# EAGLE schematic RF08bOmnibus (EAGLE 6.6.0)

## Sheet 1 of 4
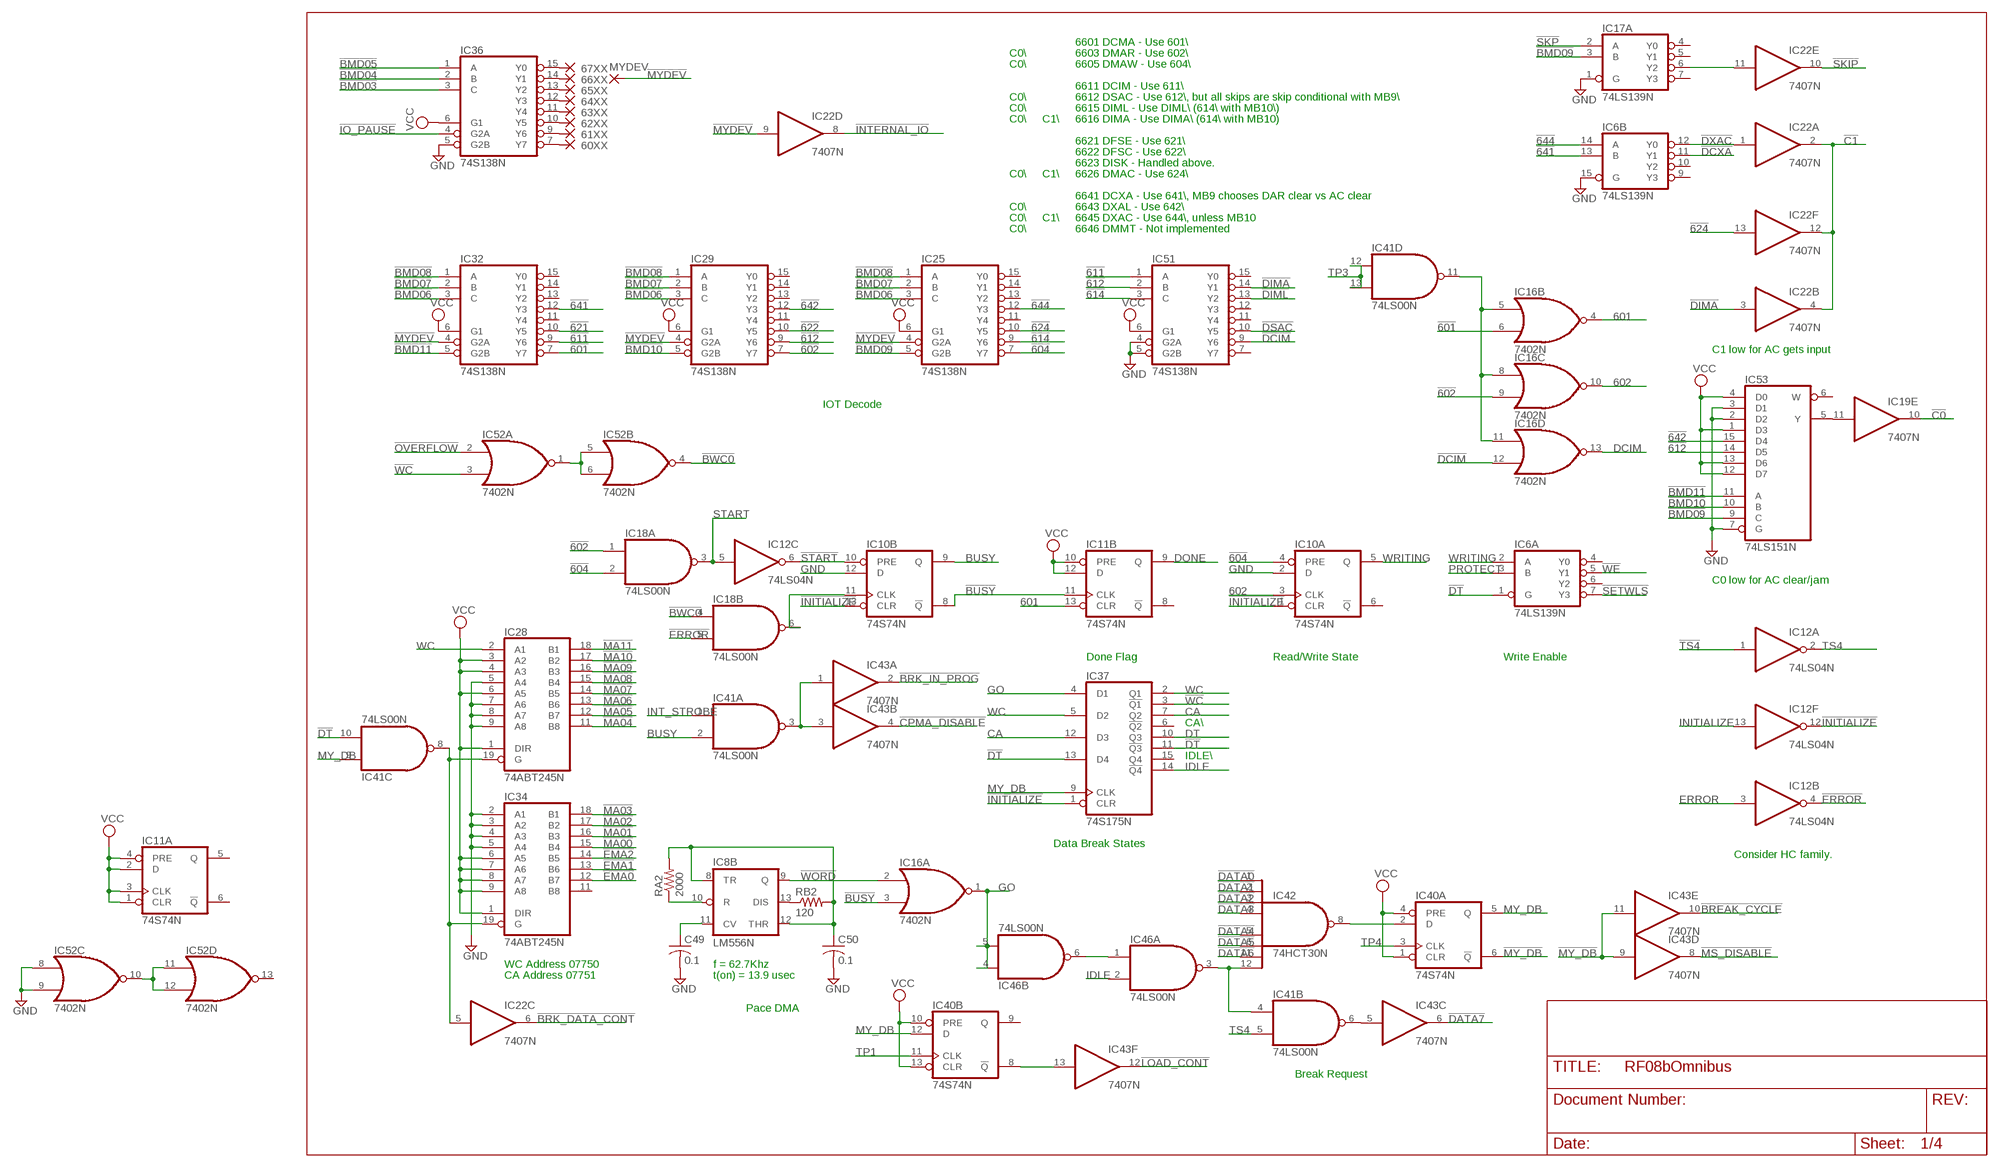
[diagram p0: schematic, sheet 1]

### Parts
60XX  1,6/0,8  [1,6/0,8]
61XX  1,6/0,8  [1,6/0,8]
62XX  1,6/0,8  [1,6/0,8]
63XX  1,6/0,8  [1,6/0,8]
64XX  1,6/0,8  [1,6/0,8]
65XX  1,6/0,8  [1,6/0,8]
66XX  1,6/0,8  [1,6/0,8]
67XX  1,6/0,8  [1,6/0,8]
C49  0.1  C-US050-025X075  [C050-025X075]
C50  0.1  C-US050-025X075  [C050-025X075]
IC6  74LS139N  74S139N  [DIL16]
IC8  LM556N  [DIL14]
IC10  74S74N  [DIL14]
IC11  74S74N  [DIL14]
IC12  74LS04N  [DIL14]
IC16  7402N  [DIL14]
IC17  74LS139N  74S139N  [DIL16]
IC18  74LS00N  [DIL14]
IC19  7407N  [DIL14]
IC22  7407N  [DIL14]
IC25  74S138N  [DIL16]
IC28  74ABT245N  74LS245N  [DIL20]
IC29  74S138N  [DIL16]
IC32  74S138N  [DIL16]
IC34  74ABT245N  74LS245N  [DIL20]
IC36  74S138N  [DIL16]
IC37  74S175N  [DIL16]
IC40  74S74N  [DIL14]
IC41  74LS00N  [DIL14]
IC42  74HCT30N  74LS30N  [DIL14]
IC43  7407N  [DIL14]
IC46  74LS00N  [DIL14]
IC51  74S138N  [DIL16]
IC52  7402N  [DIL14]
IC53  74LS151N  [DIL16]
MYDEV  1,6/0,8  [1,6/0,8]
RA2  2000  R-US_0207/10  [0207/10]
RB2  120  R-US_0207/10  [0207/10]

### Nets
601: IC11.13(B:CLR) IC16.4(B:O) ; also sheet 2
602: IC10.3(A:CLK) IC16.10(C:O)
!601: IC16.6(B:I1) IC32.7(Y7) ; also sheet 2
!602: IC16.9(C:I1) IC18.1(A:I0) IC29.7(Y7)
!604: IC10.4(A:PRE) IC18.2(A:I1) IC25.7(Y7)
!611: IC32.9(Y6) IC51.1(A)
!612: IC29.9(Y6) IC51.2(B) IC53.14(D5)
!614: IC25.9(Y6) IC51.3(C)
!621: IC32.10(Y5) ; also sheet 2
!622: IC29.10(Y5) ; also sheet 2
!624: IC22.13(F:I) IC25.10(Y5) ; also sheet 2
!641: IC6.13(B:B) IC32.12(Y3)
!642: IC29.12(Y3) IC53.15(D4) ; also sheet 2
!644: IC6.14(B:A) IC25.12(Y3)
!BMD03: IC36.3(C) ; also sheet 3
!BMD04: IC36.2(B) ; also sheet 3
!BMD05: IC36.1(A) ; also sheet 3
!BMD06: IC25.3(C) IC29.3(C) IC32.3(C) ; also sheet 3
!BMD07: IC25.2(B) IC29.2(B) IC32.2(B) ; also sheet 3
!BMD08: IC25.1(A) IC29.1(A) IC32.1(A) ; also sheet 3
!BMD09: IC17.3(A:B) IC25.5(G2B) IC53.9(C) ; also sheet 3
!BMD10: IC29.5(G2B) IC53.10(B) ; also sheet 3
!BMD11: IC32.5(G2B) IC53.11(A) ; also sheet 3
!BREAK_CYCLE: IC43.10(E:O) ; also sheet 4
!BRK_DATA_CONT: IC22.6(C:O) ; also sheet 4
!BRK_IN_PROG: IC43.2(A:O) ; also sheet 4
!BUSY: IC10.8(B:!Q) IC11.11(B:CLK) IC16.3(A:I1)
!BWC0: IC18.4(B:I0) IC52.4(B:O) ; also sheet 3
!C0: IC19.10(E:O) ; also sheet 4
!C1: IC22.2(A:O) IC22.4(B:O) IC22.12(F:O) ; also sheet 4
!CPMA_DISABLE: IC43.4(B:O) ; also sheet 4
!DATA0: IC42.1(I0) ; also sheet 2,3,4
!DATA1: IC42.2(I1) ; also sheet 2,3,4
!DATA2: IC42.3(I2) ; also sheet 2,3,4
!DATA3: IC42.4(I3) ; also sheet 2,3,4
!DATA4: IC42.5(I4) ; also sheet 2,3,4
!DATA5: IC42.6(I5) ; also sheet 2,3,4
!DATA6: IC42.11(I6) ; also sheet 2,3,4
!DATA7: IC43.6(C:O) ; also sheet 2,3,4
!DCIM: IC16.12(D:I1) IC51.9(Y6)
!DCXA: IC6.11(B:Y1) ; also sheet 2
!DIMA: IC22.3(B:I) IC51.14(Y1) ; also sheet 2
!DIML: IC51.13(Y2) ; also sheet 2
!DSAC: IC51.10(Y5) ; also sheet 2
!DT: IC6.1(A:G) IC37.11(!Q3) IC37.13(D4) IC41.10(C:I1) ; also sheet 3
!DXAC: IC6.12(B:Y0) IC22.1(A:I) ; also sheet 2
!EMA0: IC34.12(B7) ; also sheet 3,4
!EMA1: IC34.13(B6) ; also sheet 3,4
!EMA2: IC34.14(B5) ; also sheet 3,4
!ERROR: IC12.4(B:O) IC18.5(B:I1)
!INITIALIZE: IC10.1(A:CLR) IC10.13(B:CLR) IC12.12(F:O) IC37.1(CLR) ; also sheet 2
!INTERNAL_IO: IC22.8(D:O) ; also sheet 4
!IO_PAUSE: IC36.4(G2A) ; also sheet 4
!LOAD_CONT: IC43.12(F:O) ; also sheet 4
!MA00: IC34.15(B4) ; also sheet 3,4
!MA01: IC34.16(B3) ; also sheet 3,4
!MA02: IC34.17(B2) ; also sheet 3,4
!MA03: IC34.18(B1) ; also sheet 3,4
!MA04: IC28.11(B8) ; also sheet 3,4
!MA05: IC28.12(B7) ; also sheet 3,4
!MA06: IC28.13(B6) ; also sheet 3,4
!MA07: IC28.14(B5) ; also sheet 3,4
!MA08: IC28.15(B4) ; also sheet 3,4
!MA09: IC28.16(B3) ; also sheet 3,4
!MA10: IC28.17(B2) ; also sheet 3,4
!MA11: IC28.18(B1) ; also sheet 3,4
!MS_DISABLE: IC43.8(D:O) ; also sheet 4
!MY_DB: IC40.6(A:!Q) IC43.9(D:I) IC43.11(E:I) ; also sheet 3
!MYDEV: IC22.9(D:I) IC25.4(G2A) IC29.4(G2A) IC32.4(G2A) MYDEV.1(P)
!OVERFLOW: IC52.2(A:I0) ; also sheet 4
!SETWLS: IC6.7(A:Y3) ; also sheet 2
!SKIP: IC22.10(E:O) ; also sheet 4
!SKP: IC17.2(A:A) ; also sheet 2
!START: IC10.10(B:PRE) IC12.6(C:O) ; also sheet 2
!TS4: IC12.1(A:I) ; also sheet 4
!WC: IC37.3(!Q1) IC52.3(A:I1)
!WE: IC6.5(A:Y1) ; also sheet 3
!WORD: IC8.9(B:Q) IC16.2(A:I0)
BUSY: IC10.9(B:Q) IC41.2(A:I1) ; also sheet 2
CA: IC37.7(Q2) IC37.12(D3) ; also sheet 3
DCIM: IC16.13(D:O) ; also sheet 2
DONE: IC11.9(B:Q) ; also sheet 2,3
DT: IC37.10(Q3) ; also sheet 2
ERROR: IC12.3(B:I) ; also sheet 2
GND: C49.2 C50.2 IC6.15(B:G) IC10.2(A:D) IC10.12(B:D) IC17.1(A:G) IC28.5(A4) IC28.7(A6) IC28.8(A7) IC28.9(A8) IC34.2(A1) IC34.3(A2) IC34.4(A3) IC34.5(A4) IC36.5(G2B) IC51.4(G2A) IC51.5(G2B) IC52.8(C:I0) IC52.9(C:I1) IC53.2(D2) IC53.3(D1) IC53.7(G) ; also sheet 2,3,4
GO: IC16.1(A:O) IC37.4(D1) IC46.4(B:I0) IC46.5(B:I1)
IDLE: IC37.14(!Q4) IC46.2(A:I1)
INITIALIZE: IC12.13(F:I) ; also sheet 4
INT_STROBE: IC41.1(A:I0) ; also sheet 4
MY_DB: IC37.9(CLK) IC40.5(A:Q) IC40.12(B:D) IC41.9(C:I0)
N$1: 60XX.1(P) IC36.7(Y7)
N$2: IC19.11(E:I) IC53.5(Y)
N$5: 61XX.1(P) IC36.9(Y6)
N$6: 62XX.1(P) IC36.10(Y5)
N$7: 63XX.1(P) IC36.11(Y4)
N$8: 64XX.1(P) IC36.12(Y3)
N$9: 65XX.1(P) IC36.13(Y2)
N$10: 67XX.1(P) IC36.15(Y0)
N$11: 66XX.1(P) IC36.14(Y1)
N$18: IC10.11(B:CLK) IC18.6(B:O)
N$26: IC46.1(A:I0) IC46.6(B:O)
N$27: IC17.6(A:Y2) IC22.11(E:I)
N$30: IC16.5(B:I0) IC16.8(C:I0) IC16.11(D:I0) IC41.11(D:O)
N$37: IC40.8(B:!Q) IC43.13(F:I)
N$38: IC41.3(A:O) IC43.1(A:I) IC43.3(B:I)
N$39: IC41.6(B:O) IC43.5(C:I)
N$40: IC40.2(A:D) IC42.8(O)
N$43: IC22.5(C:I) IC28.19(G) IC34.19(G) IC41.8(C:O)
N$85: IC52.1(A:O) IC52.5(B:I0) IC52.6(B:I1)
N$86: IC8.13(B:DIS) RB2.1
N$87: C49.1 IC8.11(B:CV)
N$88: C50.1 IC8.8(B:TR) IC8.12(B:THR) RA2.2 RB2.2
N$89: IC8.10(B:R) RA2.1
N$92: IC52.10(C:O) IC52.11(D:I0) IC52.12(D:I1)
N$94: IC41.4(B:I0) IC42.12(I7) IC46.3(A:O)
PROTECT: IC6.3(A:B) ; also sheet 3
START: IC12.5(C:I) IC18.3(A:O)
TP1: IC40.11(B:CLK) ; also sheet 4
TP3: IC41.12(D:I0) IC41.13(D:I1) ; also sheet 3,4
TP4: IC40.3(A:CLK) ; also sheet 4
TS4: IC12.2(A:O) IC41.5(B:I1)
VCC [Power]: IC11.1(A:CLR) IC11.2(A:D) IC11.3(A:CLK) IC11.4(A:PRE) IC11.10(B:PRE) IC11.12(B:D) IC25.6(G1) IC28.1(DIR) IC28.3(A2) IC28.4(A3) IC28.6(A5) IC29.6(G1) IC32.6(G1) IC34.1(DIR) IC34.6(A5) IC34.7(A6) IC34.8(A7) IC34.9(A8) IC36.6(G1) IC40.1(A:CLR) IC40.4(A:PRE) IC40.10(B:PRE) IC40.13(B:CLR) IC51.6(G1) IC53.1(D3) IC53.4(D0) IC53.12(D7) IC53.13(D6) ; also sheet 2,3,4
WC: IC28.2(A1) IC37.2(Q1) IC37.5(D2)
WRITING: IC6.2(A:A) IC10.5(A:Q) ; also sheet 3
Unconnected: IC6.4(A:Y0) IC6.6(A:Y2) IC6.9(B:Y3) IC6.10(B:Y2) IC10.6(A:!Q) IC11.5(A:Q) IC11.6(A:!Q) IC11.8(B:!Q) IC17.4(A:Y0) IC17.5(A:Y1) IC17.7(A:Y3) IC25.11(Y4) IC25.13(Y2) IC25.14(Y1) IC25.15(Y0) IC29.11(Y4) IC29.13(Y2) IC29.14(Y1) IC29.15(Y0) IC32.11(Y4) IC32.13(Y2) IC32.14(Y1) IC32.15(Y0) IC34.11(B8) IC37.6(!Q2) IC37.15(Q4) IC40.9(B:Q) IC51.7(Y7) IC51.11(Y4) IC51.12(Y3) IC51.15(Y0) IC52.13(D:O) IC53.6(W)

### Notes on the sheet
- 6601 DCMA - Use 601\\
- C0\\ | 6603 DMAR - Use 602\\
- C0\\ | 6605 DMAW - Use 604\\
- 6611 DCIM - Use 611\\
- C0\\ | 6612 DSAC - Use 612\\, but all skips are skip conditional with MB9\\
- C0\\ | 6615 DIML - Use DIML\\ (614\\ with MB10\\)
- C0\\ | C1\\ | 6616 DIMA - Use DIMA\\ (614\\ with MB10)
- 6621 DFSE - Use 621\\
- 6622 DFSC - Use 622\\
- 6623 DISK - Handled above.
- C0\\ | C1\\ | 6626 DMAC - Use 624\\
- 6641 DCXA - Use 641\\, MB9 chooses DAR clear vs AC clear
- C0\\ | 6643 DXAL - Use 642\\
- C0\\ | C1\\ | 6645 DXAC - Use 644\\, unless MB10
- C0\\ | 6646 DMMT - Not implemented
- C1 low for AC gets input
- IOT Decode
- C0 low for AC clear/jam
- Done Flag | Read/Write State | Write Enable
- CA\\
- IDLE\\
- Data Break States
- Consider HC family.
- WC Address 07750 | f = 62.7Khz
- CA Address 07751 | t(on) = 13.9 usec
- Pace DMA
- Break Request

## Sheet 2 of 4
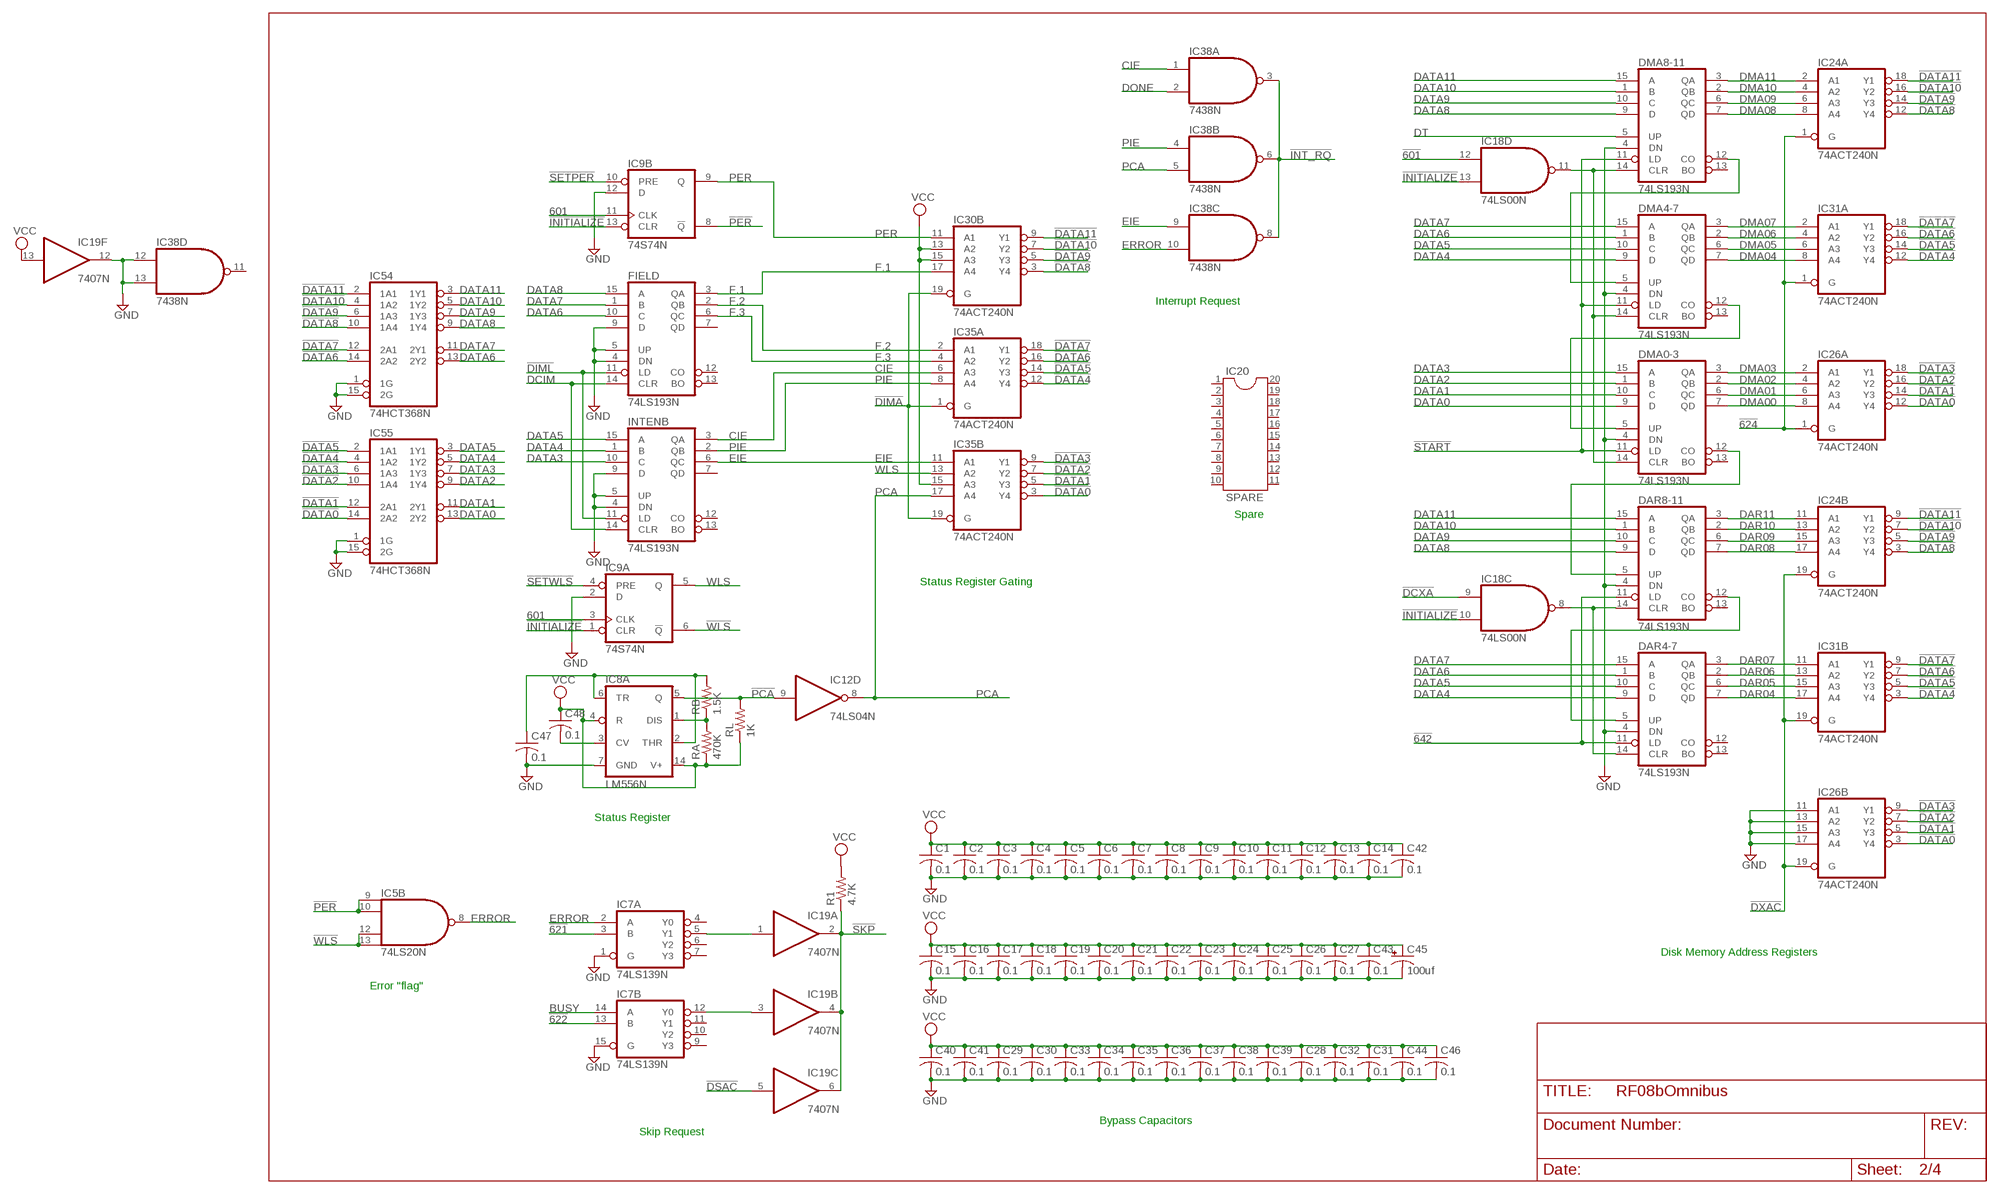
[diagram p1: schematic, sheet 2]

### Parts
C1  0.1  C-US050-025X075  [C050-025X075]
C2  0.1  C-US050-025X075  [C050-025X075]
C3  0.1  C-US050-025X075  [C050-025X075]
C4  0.1  C-US050-025X075  [C050-025X075]
C5  0.1  C-US050-025X075  [C050-025X075]
C6  0.1  C-US050-025X075  [C050-025X075]
C7  0.1  C-US050-025X075  [C050-025X075]
C8  0.1  C-US050-025X075  [C050-025X075]
C9  0.1  C-US050-025X075  [C050-025X075]
C10  0.1  C-US050-025X075  [C050-025X075]
C11  0.1  C-US050-025X075  [C050-025X075]
C12  0.1  C-US050-025X075  [C050-025X075]
C13  0.1  C-US050-025X075  [C050-025X075]
C14  0.1  C-US050-025X075  [C050-025X075]
C15  0.1  C-US050-025X075  [C050-025X075]
C16  0.1  C-US050-025X075  [C050-025X075]
C17  0.1  C-US050-025X075  [C050-025X075]
C18  0.1  C-US050-025X075  [C050-025X075]
C19  0.1  C-US050-025X075  [C050-025X075]
C20  0.1  C-US050-025X075  [C050-025X075]
C21  0.1  C-US050-025X075  [C050-025X075]
C22  0.1  C-US050-025X075  [C050-025X075]
C23  0.1  C-US050-025X075  [C050-025X075]
C24  0.1  C-US050-025X075  [C050-025X075]
C25  0.1  C-US050-025X075  [C050-025X075]
C26  0.1  C-US050-025X075  [C050-025X075]
C27  0.1  C-US050-025X075  [C050-025X075]
C28  0.1  C-US050-025X075  [C050-025X075]
C29  0.1  C-US050-025X075  [C050-025X075]
C30  0.1  C-US050-025X075  [C050-025X075]
C31  0.1  C-US050-025X075  [C050-025X075]
C32  0.1  C-US050-025X075  [C050-025X075]
C33  0.1  C-US050-025X075  [C050-025X075]
C34  0.1  C-US050-025X075  [C050-025X075]
C35  0.1  C-US050-025X075  [C050-025X075]
C36  0.1  C-US050-025X075  [C050-025X075]
C37  0.1  C-US050-025X075  [C050-025X075]
C38  0.1  C-US050-025X075  [C050-025X075]
C39  0.1  C-US050-025X075  [C050-025X075]
C40  0.1  C-US050-025X075  [C050-025X075]
C41  0.1  C-US050-025X075  [C050-025X075]
C42  0.1  C-US050-025X075  [C050-025X075]
C43  0.1  C-US050-025X075  [C050-025X075]
C44  0.1  C-US050-025X075  [C050-025X075]
C45  100uf  CPOL-USE22-6AXIAL  [E22-6]
C46  0.1  C-US050-025X075  [C050-025X075]
C47  0.1  C-US050-025X075  [C050-025X075]
C48  0.1  C-US050-025X075  [C050-025X075]
DAR4-7  74LS193N  74LS192N  [DIL16]
DAR8-11  74LS193N  74LS192N  [DIL16]
DMA0-3  74LS193N  74LS192N  [DIL16]
DMA4-7  74LS193N  74LS192N  [DIL16]
DMA8-11  74LS193N  74LS192N  [DIL16]
FIELD  74LS193N  74LS192N  [DIL16]
IC5  74LS20N  [DIL14]
IC7  74LS139N  [DIL16]
IC9  74S74N  [DIL14]
IC20  SPARE  DIL20  [DIL20]
IC24  74ACT240N  74LS240N  [DIL20]
IC26  74ACT240N  74LS240N  [DIL20]
IC30  74ACT240N  74LS240N  [DIL20]
IC31  74ACT240N  74LS240N  [DIL20]
IC35  74ACT240N  74LS240N  [DIL20]
IC38  7438N  [DIL14]
IC54  74HCT368N  74368N  [DIL16]
IC55  74HCT368N  74368N  [DIL16]
INTENB  74LS193N  74LS192N  [DIL16]
R1  4.7K  R-US_0207/10  [0207/10]
RA  470K  R-US_0207/10  [0207/10]
RB  1.5K  R-US_0207/10  [0207/10]
RL  1K  R-US_0207/10  [0207/10]

### Nets
601: IC9.3(A:CLK) IC9.11(B:CLK) ; also sheet 1
!601: IC18.12(D:I0) ; also sheet 1
!621: IC7.3(A:B) ; also sheet 1
!622: IC7.13(B:B) ; also sheet 1
!624: IC24.1(A:G) IC26.1(A:G) IC31.1(A:G) ; also sheet 1
!642: DAR4-7.11(LD) DAR8-11.11(LD) ; also sheet 1
!DATA0: IC26.3(B:Y4) IC26.12(A:Y4) IC35.3(B:Y4) IC55.14(2A2) ; also sheet 1,3,4
!DATA1: IC26.5(B:Y3) IC26.14(A:Y3) IC35.5(B:Y3) IC55.12(2A1) ; also sheet 1,3,4
!DATA2: IC26.7(B:Y2) IC26.16(A:Y2) IC35.7(B:Y2) IC55.10(1A4) ; also sheet 1,3,4
!DATA3: IC26.9(B:Y1) IC26.18(A:Y1) IC35.9(B:Y1) IC55.6(1A3) ; also sheet 1,3,4
!DATA4: IC31.3(B:Y4) IC31.12(A:Y4) IC35.12(A:Y4) IC55.4(1A2) ; also sheet 1,3,4
!DATA5: IC31.5(B:Y3) IC31.14(A:Y3) IC35.14(A:Y3) IC55.2(1A1) ; also sheet 1,3,4
!DATA6: IC31.7(B:Y2) IC31.16(A:Y2) IC35.16(A:Y2) IC54.14(2A2) ; also sheet 1,3,4
!DATA7: IC31.9(B:Y1) IC31.18(A:Y1) IC35.18(A:Y1) IC54.12(2A1) ; also sheet 1,3,4
!DATA8: IC24.3(B:Y4) IC24.12(A:Y4) IC30.3(B:Y4) IC54.10(1A4) ; also sheet 3,4
!DATA9: IC24.5(B:Y3) IC24.14(A:Y3) IC30.5(B:Y3) IC54.6(1A3) ; also sheet 3,4
!DATA10: IC24.7(B:Y2) IC24.16(A:Y2) IC30.7(B:Y2) IC54.4(1A2) ; also sheet 3,4
!DATA11: IC24.9(B:Y1) IC24.18(A:Y1) IC30.9(B:Y1) IC54.2(1A1) ; also sheet 3,4
!DCXA: IC18.9(C:I0) ; also sheet 1
!DIMA: IC30.19(B:G) IC35.1(A:G) IC35.19(B:G) ; also sheet 1
!DIML: FIELD.11(LD) INTENB.11(LD) ; also sheet 1
!DSAC: IC19.5(C:I) ; also sheet 1
!DXAC: IC24.19(B:G) IC26.19(B:G) IC31.19(B:G) ; also sheet 1
!INITIALIZE: IC9.1(A:CLR) IC9.13(B:CLR) IC18.10(C:I1) IC18.13(D:I1) ; also sheet 1
!INT_RQ: IC38.3(A:O) IC38.6(B:O) IC38.8(C:O)
!PCA: IC8.5(A:Q) IC12.9(D:I) RL.2
!PER: IC5.9(B:I0) IC5.10(B:I1) IC9.8(B:!Q)
!SETPER: IC9.10(B:PRE) ; also sheet 3
!SETWLS: IC9.4(A:PRE) ; also sheet 1
!SKP: IC19.2(A:O) IC19.4(B:O) IC19.6(C:O) R1.1 ; also sheet 1
!START: DMA0-3.11(LD) DMA4-7.11(LD) DMA8-11.11(LD) ; also sheet 1
!WLS: IC5.12(B:I2) IC5.13(B:I3) IC9.6(A:!Q)
BUSY: IC7.14(B:A) ; also sheet 1
CIE: IC35.6(A:A3) IC38.1(A:I0) INTENB.3(QA) ; also sheet 3
DAR04: DAR4-7.7(QD) IC31.17(B:A4) ; also sheet 3
DAR05: DAR4-7.6(QC) IC31.15(B:A3) ; also sheet 3
DAR06: DAR4-7.2(QB) IC31.13(B:A2) ; also sheet 3
DAR07: DAR4-7.3(QA) IC31.11(B:A1) ; also sheet 3
DAR08: DAR8-11.7(QD) IC24.17(B:A4) ; also sheet 3
DAR09: DAR8-11.6(QC) IC24.15(B:A3) ; also sheet 3
DAR10: DAR8-11.2(QB) IC24.13(B:A2) ; also sheet 3
DAR11: DAR8-11.3(QA) IC24.11(B:A1) ; also sheet 3
DATA0: DMA0-3.9(D) IC55.13(2Y2)
DATA1: DMA0-3.10(C) IC55.11(2Y1)
DATA2: DMA0-3.1(B) IC55.9(1Y4)
DATA3: DMA0-3.15(A) IC55.7(1Y3) INTENB.10(C)
DATA4: DAR4-7.9(D) DMA4-7.9(D) IC55.5(1Y2) INTENB.1(B)
DATA5: DAR4-7.10(C) DMA4-7.10(C) IC55.3(1Y1) INTENB.15(A)
DATA6: DAR4-7.1(B) DMA4-7.1(B) FIELD.10(C) IC54.13(2Y2)
DATA7: DAR4-7.15(A) DMA4-7.15(A) FIELD.1(B) IC54.11(2Y1)
DATA8: DAR8-11.9(D) DMA8-11.9(D) FIELD.15(A) IC54.9(1Y4)
DATA9: DAR8-11.10(C) DMA8-11.10(C) IC54.7(1Y3)
DATA10: DAR8-11.1(B) DMA8-11.1(B) IC54.5(1Y2)
DATA11: DAR8-11.15(A) DMA8-11.15(A) IC54.3(1Y1)
DCIM: FIELD.14(CLR) INTENB.14(CLR) ; also sheet 1
DMA00: DMA0-3.7(QD) IC26.8(A:A4) ; also sheet 3
DMA01: DMA0-3.6(QC) IC26.6(A:A3) ; also sheet 3
DMA02: DMA0-3.2(QB) IC26.4(A:A2) ; also sheet 3
DMA03: DMA0-3.3(QA) IC26.2(A:A1) ; also sheet 3
DMA04: DMA4-7.7(QD) IC31.8(A:A4) ; also sheet 3
DMA05: DMA4-7.6(QC) IC31.6(A:A3) ; also sheet 3
DMA06: DMA4-7.2(QB) IC31.4(A:A2) ; also sheet 3
DMA07: DMA4-7.3(QA) IC31.2(A:A1) ; also sheet 3
DMA08: DMA8-11.7(QD) IC24.8(A:A4) ; also sheet 3
DMA09: DMA8-11.6(QC) IC24.6(A:A3) ; also sheet 3
DMA10: DMA8-11.2(QB) IC24.4(A:A2) ; also sheet 3
DMA11: DMA8-11.3(QA) IC24.2(A:A1) ; also sheet 3
DONE: IC38.2(A:I1) ; also sheet 1,3
DT: DMA8-11.5(UP) ; also sheet 1
EIE: IC35.11(B:A1) IC38.9(C:I0) INTENB.6(QC) ; also sheet 3
ERROR: IC5.8(B:O) IC7.2(A:A) IC38.10(C:I1) ; also sheet 1
F.1: FIELD.3(QA) IC30.17(B:A4) ; also sheet 3
F.2: FIELD.2(QB) IC35.2(A:A1) ; also sheet 3
F.3: FIELD.6(QC) IC35.4(A:A2) ; also sheet 3
GND: C1.2 C2.2 C3.2 C4.2 C5.2 C6.2 C7.2 C8.2 C9.2 C10.2 C11.2 C12.2 C13.2 C14.2 C15.2 C16.2 C17.2 C18.2 C19.2 C20.2 C21.2 C22.2 C23.2 C24.2 C25.2 C26.2 C27.2 C28.2 C29.2 C30.2 C31.2 C32.2 C33.2 C34.2 C35.2 C36.2 C37.2 C38.2 C39.2 C40.2 C41.2 C42.2 C43.2 C44.2 C45.- C46.2 C47.2 DAR4-7.4(DN) DAR8-11.4(DN) DMA0-3.4(DN) DMA4-7.4(DN) DMA8-11.4(DN) FIELD.4(DN) FIELD.5(UP) FIELD.9(D) IC7.1(A:G) IC7.15(B:G) IC8.7(A:GND) IC9.2(A:D) IC9.12(B:D) IC19.12(F:O) IC26.11(B:A1) IC26.13(B:A2) IC26.15(B:A3) IC26.17(B:A4) IC38.12(D:I0) IC38.13(D:I1) IC54.1(1G) IC54.15(2G) IC55.1(1G) IC55.15(2G) INTENB.4(DN) INTENB.5(UP) INTENB.9(D) ; also sheet 1,3,4
N$3: DMA0-3.5(UP) DMA4-7.12(CO)
N$12: DAR4-7.14(CLR) DAR8-11.14(CLR) IC18.8(C:O)
N$13: DMA4-7.5(UP) DMA8-11.12(CO)
N$16: DAR8-11.5(UP) DMA0-3.12(CO)
N$22: DMA0-3.14(CLR) DMA4-7.14(CLR) DMA8-11.14(CLR) IC18.11(D:O)
N$25: DAR4-7.5(UP) DAR8-11.12(CO)
N$28: IC7.5(A:Y1) IC19.1(A:I)
N$29: IC8.1(A:DIS) RA.2 RB.1
N$32: C47.1 IC8.2(A:THR) IC8.6(A:TR) RB.2
N$33: IC7.12(B:Y0) IC19.3(B:I)
N$34: C48.2 IC8.3(A:CV)
PCA: IC12.8(D:O) IC35.17(B:A4) IC38.5(B:I1)
PER: IC9.9(B:Q) IC30.11(B:A1) ; also sheet 3
PIE: IC35.8(A:A4) IC38.4(B:I0) INTENB.2(QB) ; also sheet 3
VCC [Power]: C1.1 C2.1 C3.1 C4.1 C5.1 C6.1 C7.1 C8.1 C9.1 C10.1 C11.1 C12.1 C13.1 C14.1 C15.1 C16.1 C17.1 C18.1 C19.1 C20.1 C21.1 C22.1 C23.1 C24.1 C25.1 C26.1 C27.1 C28.1 C29.1 C30.1 C31.1 C32.1 C33.1 C34.1 C35.1 C36.1 C37.1 C38.1 C39.1 C40.1 C41.1 C42.1 C43.1 C44.1 C45.+ C46.1 C48.1 IC8.4(A:R) IC8.14(A:V+) IC19.13(F:I) IC30.13(B:A2) IC30.15(B:A3) IC35.15(B:A3) R1.2 RA.1 RL.1 ; also sheet 1,3,4
WLS: IC9.5(A:Q) IC35.13(B:A2) ; also sheet 3
Unconnected: DAR4-7.12(CO) DAR4-7.13(BO) DAR8-11.13(BO) DMA0-3.13(BO) DMA4-7.13(BO) DMA8-11.13(BO) FIELD.7(QD) FIELD.12(CO) FIELD.13(BO) IC7.4(A:Y0) IC7.6(A:Y2) IC7.7(A:Y3) IC7.9(B:Y3) IC7.10(B:Y2) IC7.11(B:Y1) IC20.1 IC20.2 IC20.3 IC20.4 IC20.5 IC20.6 IC20.7 IC20.8 IC20.9 IC20.10 IC20.11 IC20.12 IC20.13 IC20.14 IC20.15 IC20.16 IC20.17 IC20.18 IC20.19 IC20.20 IC38.11(D:O) INTENB.7(QD) INTENB.12(CO) INTENB.13(BO)

### Notes on the sheet
- Interrupt Request
- Spare
- Status Register Gating
- Status Register
- Disk Memory Address Registers
- Error "flag"
- Bypass Capacitors
- Skip Request

## Sheet 3 of 4
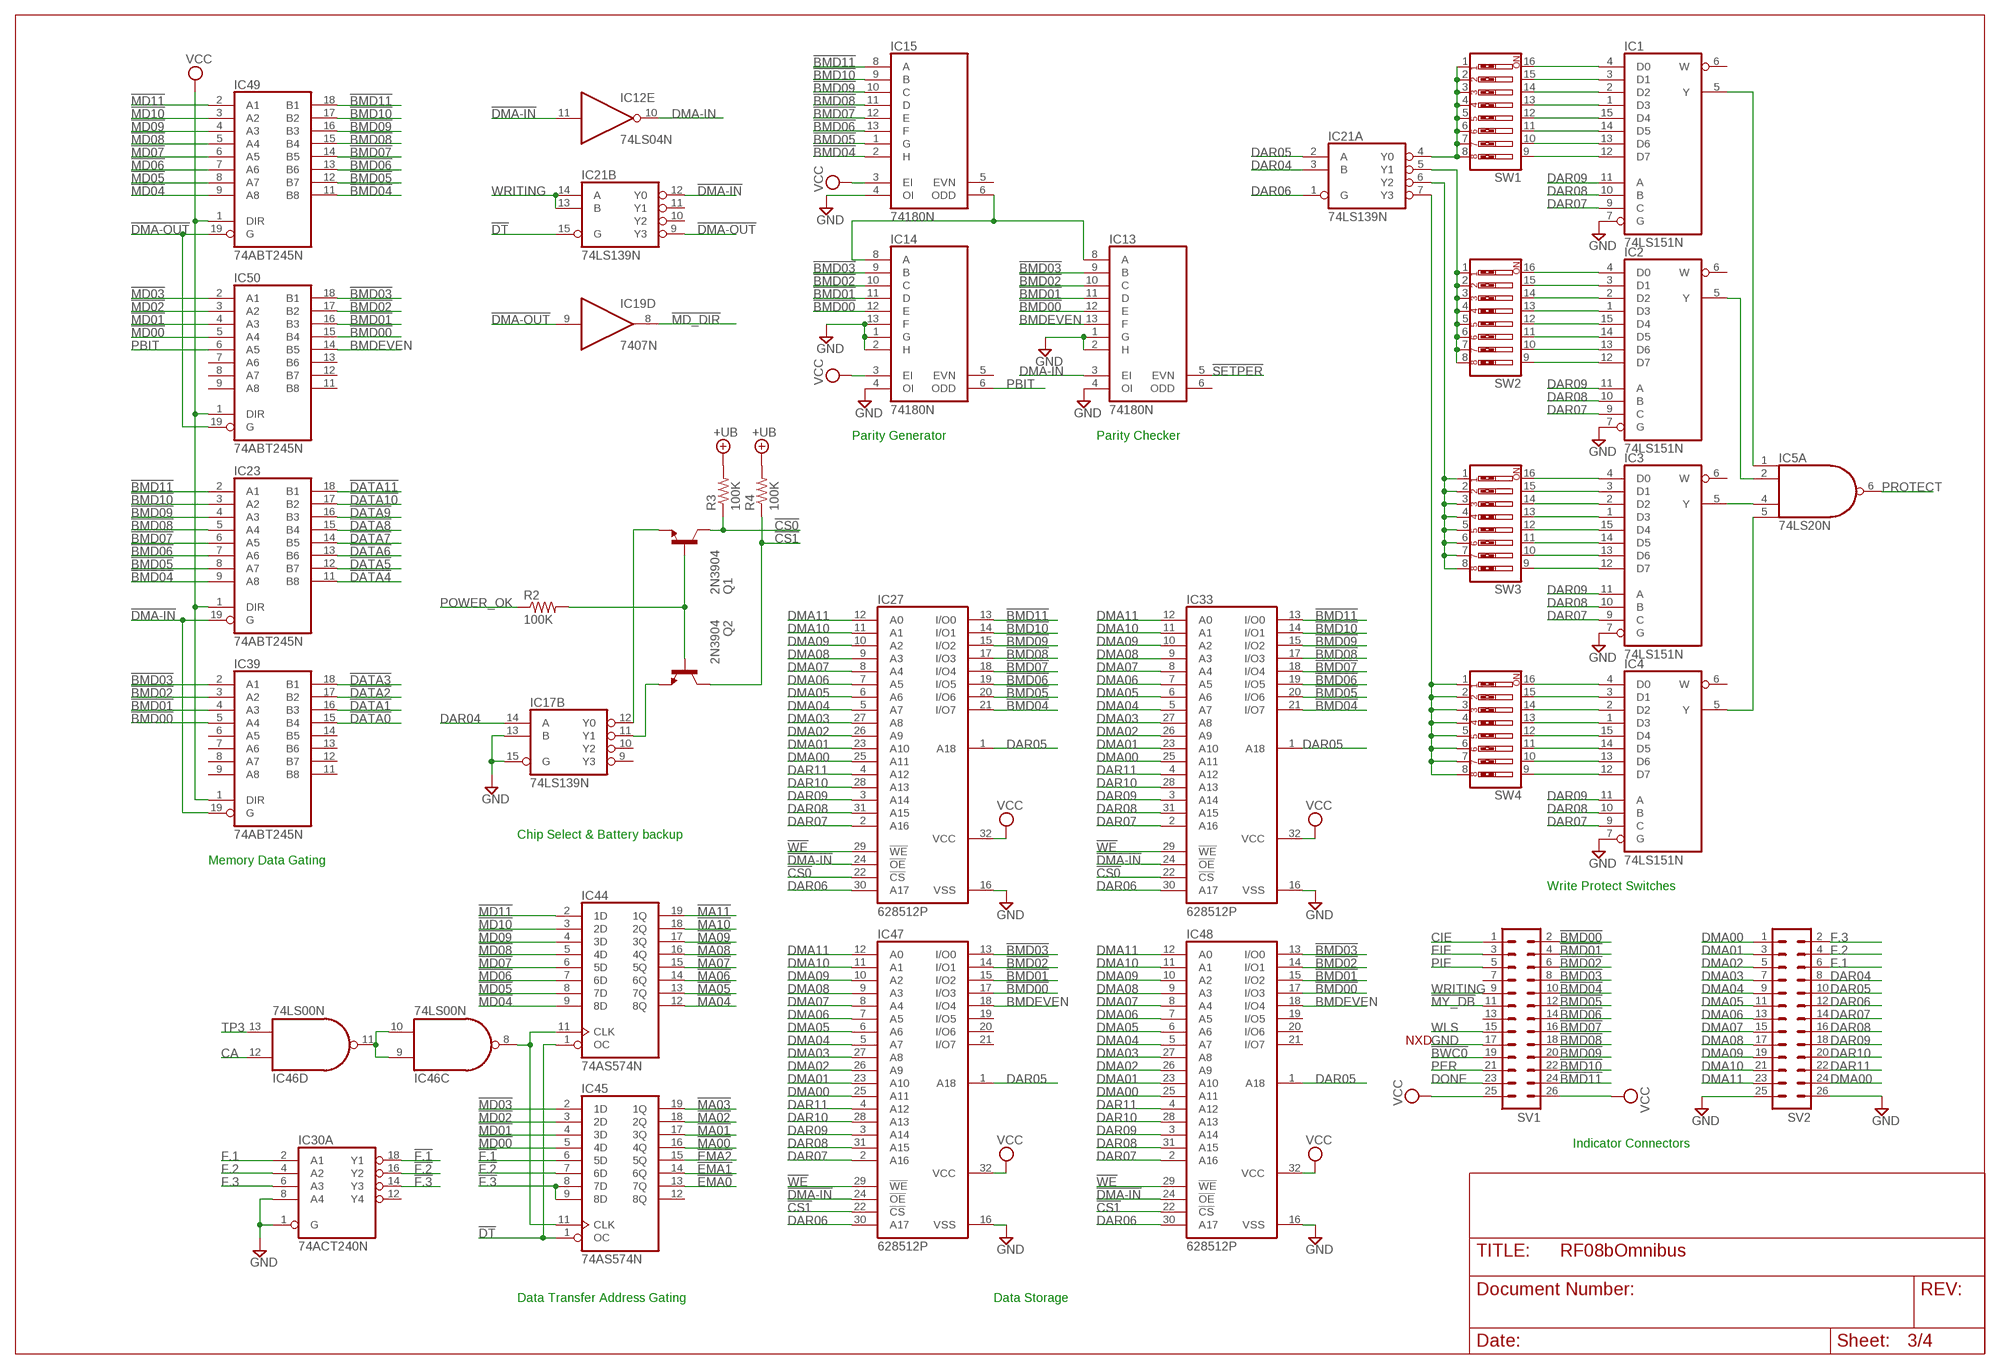
[diagram p2: schematic, sheet 3]

### Parts
IC1  74LS151N  [DIL16]
IC2  74LS151N  [DIL16]
IC3  74LS151N  [DIL16]
IC4  74LS151N  [DIL16]
IC13  74180N  [DIL14]
IC14  74180N  [DIL14]
IC15  74180N  [DIL14]
IC21  74LS139N  [DIL16]
IC23  74ABT245N  74LS245N  [DIL20]
IC27  628512P  [DIL32]
IC33  628512P  [DIL32]
IC39  74ABT245N  74LS245N  [DIL20]
IC44  74AS574N  [DIL20]
IC45  74AS574N  [DIL20]
IC47  628512P  [DIL32]
IC48  628512P  [DIL32]
IC49  74ABT245N  74LS245N  [DIL20]
IC50  74ABT245N  74LS245N  [DIL20]
Q1  2N3904  [TO92]
Q2  2N3904  [TO92]
R2  100K  R-US_0207/10  [0207/10]
R3  100K  R-US_0207/10  [0207/10]
R4  100K  R-US_0207/10  [0207/10]
SV1  MA13-2  [MA13-2]
SV2  MA13-2  [MA13-2]
SW1  SW_DIP-8  [EDG-08]
SW2  SW_DIP-8  [EDG-08]
SW3  SW_DIP-8  [EDG-08]
SW4  SW_DIP-8  [EDG-08]

### Nets
!BMD00: IC13.12(E) IC14.12(E) IC39.5(A4) IC47.17(I/O3) IC48.17(I/O3) IC50.15(B4) SV1.2
!BMD01: IC13.11(D) IC14.11(D) IC39.4(A3) IC47.15(I/O2) IC48.15(I/O2) IC50.16(B3) SV1.4
!BMD02: IC13.10(C) IC14.10(C) IC39.3(A2) IC47.14(I/O1) IC48.14(I/O1) IC50.17(B2) SV1.6
!BMD03: IC13.9(B) IC14.9(B) IC39.2(A1) IC47.13(I/O0) IC48.13(I/O0) IC50.18(B1) SV1.8 ; also sheet 1
!BMD04: IC15.2(H) IC23.9(A8) IC27.21(I/O7) IC33.21(I/O7) IC49.11(B8) SV1.10 ; also sheet 1
!BMD05: IC15.1(G) IC23.8(A7) IC27.20(I/O6) IC33.20(I/O6) IC49.12(B7) SV1.12 ; also sheet 1
!BMD06: IC15.13(F) IC23.7(A6) IC27.19(I/O5) IC33.19(I/O5) IC49.13(B6) SV1.14 ; also sheet 1
!BMD07: IC15.12(E) IC23.6(A5) IC27.18(I/O4) IC33.18(I/O4) IC49.14(B5) SV1.16 ; also sheet 1
!BMD08: IC15.11(D) IC23.5(A4) IC27.17(I/O3) IC33.17(I/O3) IC49.15(B4) SV1.18 ; also sheet 1
!BMD09: IC15.10(C) IC23.4(A3) IC27.15(I/O2) IC33.15(I/O2) IC49.16(B3) SV1.20 ; also sheet 1
!BMD10: IC15.9(B) IC23.3(A2) IC27.14(I/O1) IC33.14(I/O1) IC49.17(B2) SV1.22 ; also sheet 1
!BMD11: IC15.8(A) IC23.2(A1) IC27.13(I/O0) IC33.13(I/O0) IC49.18(B1) SV1.24 ; also sheet 1
!BWC0: SV1.19 ; also sheet 1
!CS0: IC27.22(!CS) IC33.22(!CS) Q1.1(C) R3.1
!CS1: IC47.22(!CS) IC48.22(!CS) Q2.1(C) R4.1
!DATA0: IC39.15(B4) ; also sheet 1,2,4
!DATA1: IC39.16(B3) ; also sheet 1,2,4
!DATA2: IC39.17(B2) ; also sheet 1,2,4
!DATA3: IC39.18(B1) ; also sheet 1,2,4
!DATA4: IC23.11(B8) ; also sheet 1,2,4
!DATA5: IC23.12(B7) ; also sheet 1,2,4
!DATA6: IC23.13(B6) ; also sheet 1,2,4
!DATA7: IC23.14(B5) ; also sheet 1,2,4
!DATA8: IC23.15(B4) ; also sheet 2,4
!DATA9: IC23.16(B3) ; also sheet 2,4
!DATA10: IC23.17(B2) ; also sheet 2,4
!DATA11: IC23.18(B1) ; also sheet 2,4
!DMA-IN: IC12.11(E:I) IC21.12(B:Y0) IC23.19(G) IC27.24(!OE) IC33.24(!OE) IC39.19(G) IC47.24(!OE) IC48.24(!OE)
!DMA-OUT: IC19.9(D:I) IC21.9(B:Y3) IC49.19(G) IC50.19(G)
!DT: IC21.15(B:G) IC44.1(OC) IC45.1(OC) ; also sheet 1
!EMA0: IC45.13(7Q) ; also sheet 1,4
!EMA1: IC45.14(6Q) ; also sheet 1,4
!EMA2: IC45.15(5Q) ; also sheet 1,4
!F.1: IC30.18(A:Y1) IC45.6(5D)
!F.2: IC30.16(A:Y2) IC45.7(6D)
!F.3: IC30.14(A:Y3) IC45.8(7D) IC45.9(8D)
!MA00: IC45.16(4Q) ; also sheet 1,4
!MA01: IC45.17(3Q) ; also sheet 1,4
!MA02: IC45.18(2Q) ; also sheet 1,4
!MA03: IC45.19(1Q) ; also sheet 1,4
!MA04: IC44.12(8Q) ; also sheet 1,4
!MA05: IC44.13(7Q) ; also sheet 1,4
!MA06: IC44.14(6Q) ; also sheet 1,4
!MA07: IC44.15(5Q) ; also sheet 1,4
!MA08: IC44.16(4Q) ; also sheet 1,4
!MA09: IC44.17(3Q) ; also sheet 1,4
!MA10: IC44.18(2Q) ; also sheet 1,4
!MA11: IC44.19(1Q) ; also sheet 1,4
!MD00: IC45.5(4D) IC50.5(A4) ; also sheet 4
!MD01: IC45.4(3D) IC50.4(A3) ; also sheet 4
!MD02: IC45.3(2D) IC50.3(A2) ; also sheet 4
!MD03: IC45.2(1D) IC50.2(A1) ; also sheet 4
!MD04: IC44.9(8D) IC49.9(A8) ; also sheet 4
!MD05: IC44.8(7D) IC49.8(A7) ; also sheet 4
!MD06: IC44.7(6D) IC49.7(A6) ; also sheet 4
!MD07: IC44.6(5D) IC49.6(A5) ; also sheet 4
!MD08: IC44.5(4D) IC49.5(A4) ; also sheet 4
!MD09: IC44.4(3D) IC49.4(A3) ; also sheet 4
!MD10: IC44.3(2D) IC49.3(A2) ; also sheet 4
!MD11: IC44.2(1D) IC49.2(A1) ; also sheet 4
!MD_DIR: IC19.8(D:O) ; also sheet 4
!MY_DB: SV1.11 ; also sheet 1
!SETPER: IC13.5(EVN) ; also sheet 2
!WE: IC27.29(!WE) IC33.29(!WE) IC47.29(!WE) IC48.29(!WE) ; also sheet 1
+UB: R3.2 R4.2
BMDEVEN: IC13.13(F) IC47.18(I/O4) IC48.18(I/O4) IC50.14(B5)
CA: IC46.12(D:I0) ; also sheet 1
CIE: SV1.1 ; also sheet 2
DAR04: IC17.14(B:A) IC21.3(A:B) SV2.8 ; also sheet 2
DAR05: IC21.2(A:A) IC27.1(A18) IC33.1(A18) IC47.1(A18) IC48.1(A18) SV2.10 ; also sheet 2
DAR06: IC21.1(A:G) IC27.30(A17) IC33.30(A17) IC47.30(A17) IC48.30(A17) SV2.12 ; also sheet 2
DAR07: IC1.9(C) IC2.9(C) IC3.9(C) IC4.9(C) IC27.2(A16) IC33.2(A16) IC47.2(A16) IC48.2(A16) SV2.14 ; also sheet 2
DAR08: IC1.10(B) IC2.10(B) IC3.10(B) IC4.10(B) IC27.31(A15) IC33.31(A15) IC47.31(A15) IC48.31(A15) SV2.16 ; also sheet 2
DAR09: IC1.11(A) IC2.11(A) IC3.11(A) IC4.11(A) IC27.3(A14) IC33.3(A14) IC47.3(A14) IC48.3(A14) SV2.18 ; also sheet 2
DAR10: IC27.28(A13) IC33.28(A13) IC47.28(A13) IC48.28(A13) SV2.20 ; also sheet 2
DAR11: IC27.4(A12) IC33.4(A12) IC47.4(A12) IC48.4(A12) SV2.22 ; also sheet 2
DMA00: IC27.25(A11) IC33.25(A11) IC47.25(A11) IC48.25(A11) SV2.1 SV2.24 ; also sheet 2
DMA01: IC27.23(A10) IC33.23(A10) IC47.23(A10) IC48.23(A10) SV2.3 ; also sheet 2
DMA02: IC27.26(A9) IC33.26(A9) IC47.26(A9) IC48.26(A9) SV2.5 ; also sheet 2
DMA03: IC27.27(A8) IC33.27(A8) IC47.27(A8) IC48.27(A8) SV2.7 ; also sheet 2
DMA04: IC27.5(A7) IC33.5(A7) IC47.5(A7) IC48.5(A7) SV2.9 ; also sheet 2
DMA05: IC27.6(A6) IC33.6(A6) IC47.6(A6) IC48.6(A6) SV2.11 ; also sheet 2
DMA06: IC27.7(A5) IC33.7(A5) IC47.7(A5) IC48.7(A5) SV2.13 ; also sheet 2
DMA07: IC27.8(A4) IC33.8(A4) IC47.8(A4) IC48.8(A4) SV2.15 ; also sheet 2
DMA08: IC27.9(A3) IC33.9(A3) IC47.9(A3) IC48.9(A3) SV2.17 ; also sheet 2
DMA09: IC27.10(A2) IC33.10(A2) IC47.10(A2) IC48.10(A2) SV2.19 ; also sheet 2
DMA10: IC27.11(A1) IC33.11(A1) IC47.11(A1) IC48.11(A1) SV2.21 ; also sheet 2
DMA11: IC27.12(A0) IC33.12(A0) IC47.12(A0) IC48.12(A0) SV2.23 ; also sheet 2
DMA-IN: IC12.10(E:O) IC13.3(EI)
DONE: SV1.23 ; also sheet 1,2
EIE: SV1.3 ; also sheet 2
F.1: IC30.2(A:A1) SV2.6 ; also sheet 2
F.2: IC30.4(A:A2) SV2.4 ; also sheet 2
F.3: IC30.6(A:A3) SV2.2 ; also sheet 2
GND: IC1.7(G) IC2.7(G) IC3.7(G) IC4.7(G) IC13.1(G) IC13.2(H) IC13.4(OI) IC14.1(G) IC14.2(H) IC14.4(OI) IC14.13(F) IC15.4(OI) IC17.13(B:B) IC17.15(B:G) IC27.16(VSS) IC30.1(A:G) IC30.8(A:A4) IC33.16(VSS) IC47.16(VSS) IC48.16(VSS) SV1.17 SV2.25 SV2.26 ; also sheet 1,2,4
N$4: IC21.4(A:Y0) SW1.1 SW1.2 SW1.3 SW1.4 SW1.5 SW1.6 SW1.7 SW1.8
N$14: IC13.8(A) IC14.8(A) IC15.6(ODD)
N$15: IC2.5(Y) IC5.2(A:I1)
N$17: IC21.5(A:Y1) SW2.1 SW2.2 SW2.3 SW2.4 SW2.5 SW2.6 SW2.7 SW2.8
N$19: IC21.6(A:Y2) SW3.1 SW3.2 SW3.3 SW3.4 SW3.5 SW3.6 SW3.7 SW3.8
N$20: IC21.7(A:Y3) SW4.1 SW4.2 SW4.3 SW4.4 SW4.5 SW4.6 SW4.7 SW4.8
N$21: IC3.5(Y) IC5.4(A:I2)
N$23: IC1.5(Y) IC5.1(A:I0)
N$24: IC4.5(Y) IC5.5(A:I3)
N$41: IC44.11(CLK) IC45.11(CLK) IC46.8(C:O)
N$42: IC46.9(C:I0) IC46.10(C:I1) IC46.11(D:O)
N$53: IC1.4(D0) SW1.16
N$54: IC1.3(D1) SW1.15
N$55: IC1.2(D2) SW1.14
N$56: IC1.1(D3) SW1.13
N$57: IC1.14(D5) SW1.11
N$58: IC1.13(D6) SW1.10
N$59: IC1.12(D7) SW1.9
N$60: IC1.15(D4) SW1.12
N$61: IC2.4(D0) SW2.16
N$62: IC2.3(D1) SW2.15
N$63: IC2.2(D2) SW2.14
N$64: IC2.1(D3) SW2.13
N$65: IC2.14(D5) SW2.11
N$66: IC2.13(D6) SW2.10
N$67: IC2.12(D7) SW2.9
N$68: IC3.4(D0) SW3.16
N$69: IC3.3(D1) SW3.15
N$70: IC3.2(D2) SW3.14
N$71: IC3.1(D3) SW3.13
N$72: IC3.14(D5) SW3.11
N$73: IC3.13(D6) SW3.10
N$74: IC3.12(D7) SW3.9
N$75: IC4.4(D0) SW4.16
N$76: IC4.3(D1) SW4.15
N$77: IC4.2(D2) SW4.14
N$78: IC4.1(D3) SW4.13
N$79: IC4.14(D5) SW4.11
N$80: IC4.13(D6) SW4.10
N$81: IC4.12(D7) SW4.9
N$82: IC4.15(D4) SW4.12
N$83: IC3.15(D4) SW3.12
N$84: IC2.15(D4) SW2.12
N$90: IC17.12(B:Y0) Q1.3(E)
N$91: Q1.2(B) Q2.2(B) R2.2
N$93: IC17.11(B:Y1) Q2.3(E)
PBIT: IC14.6(ODD) IC50.6(A5)
PER: SV1.21 ; also sheet 2
PIE: SV1.5 ; also sheet 2
POWER_OK: R2.1 ; also sheet 4
PROTECT: IC5.6(A:O) ; also sheet 1
TP3: IC46.13(D:I1) ; also sheet 1,4
VCC [Power]: IC14.3(EI) IC15.3(EI) IC23.1(DIR) IC27.32(VCC) IC33.32(VCC) IC39.1(DIR) IC47.32(VCC) IC48.32(VCC) IC49.1(DIR) IC50.1(DIR) SV1.25 SV1.26 ; also sheet 1,2,4
WLS: SV1.15 ; also sheet 2
WRITING: IC21.13(B:B) IC21.14(B:A) SV1.9 ; also sheet 1
Unconnected: IC1.6(W) IC2.6(W) IC3.6(W) IC4.6(W) IC13.6(ODD) IC14.5(EVN) IC15.5(EVN) IC17.9(B:Y3) IC17.10(B:Y2) IC21.10(B:Y2) IC21.11(B:Y1) IC30.12(A:Y4) IC39.6(A5) IC39.7(A6) IC39.8(A7) IC39.9(A8) IC39.11(B8) IC39.12(B7) IC39.13(B6) IC39.14(B5) IC45.12(8Q) IC47.19(I/O5) IC47.20(I/O6) IC47.21(I/O7) IC48.19(I/O5) IC48.20(I/O6) IC48.21(I/O7) IC50.7(A6) IC50.8(A7) IC50.9(A8) IC50.11(B8) IC50.12(B7) IC50.13(B6) SV1.7 SV1.13

### Notes on the sheet
- Parity Generator | Parity Checker
- Chip Select & Battery backup
- Memory Data Gating
- Write Protect Switches
- NXD
- Indicator Connectors
- Data Transfer Address Gating | Data Storage

## Sheet 4 of 4
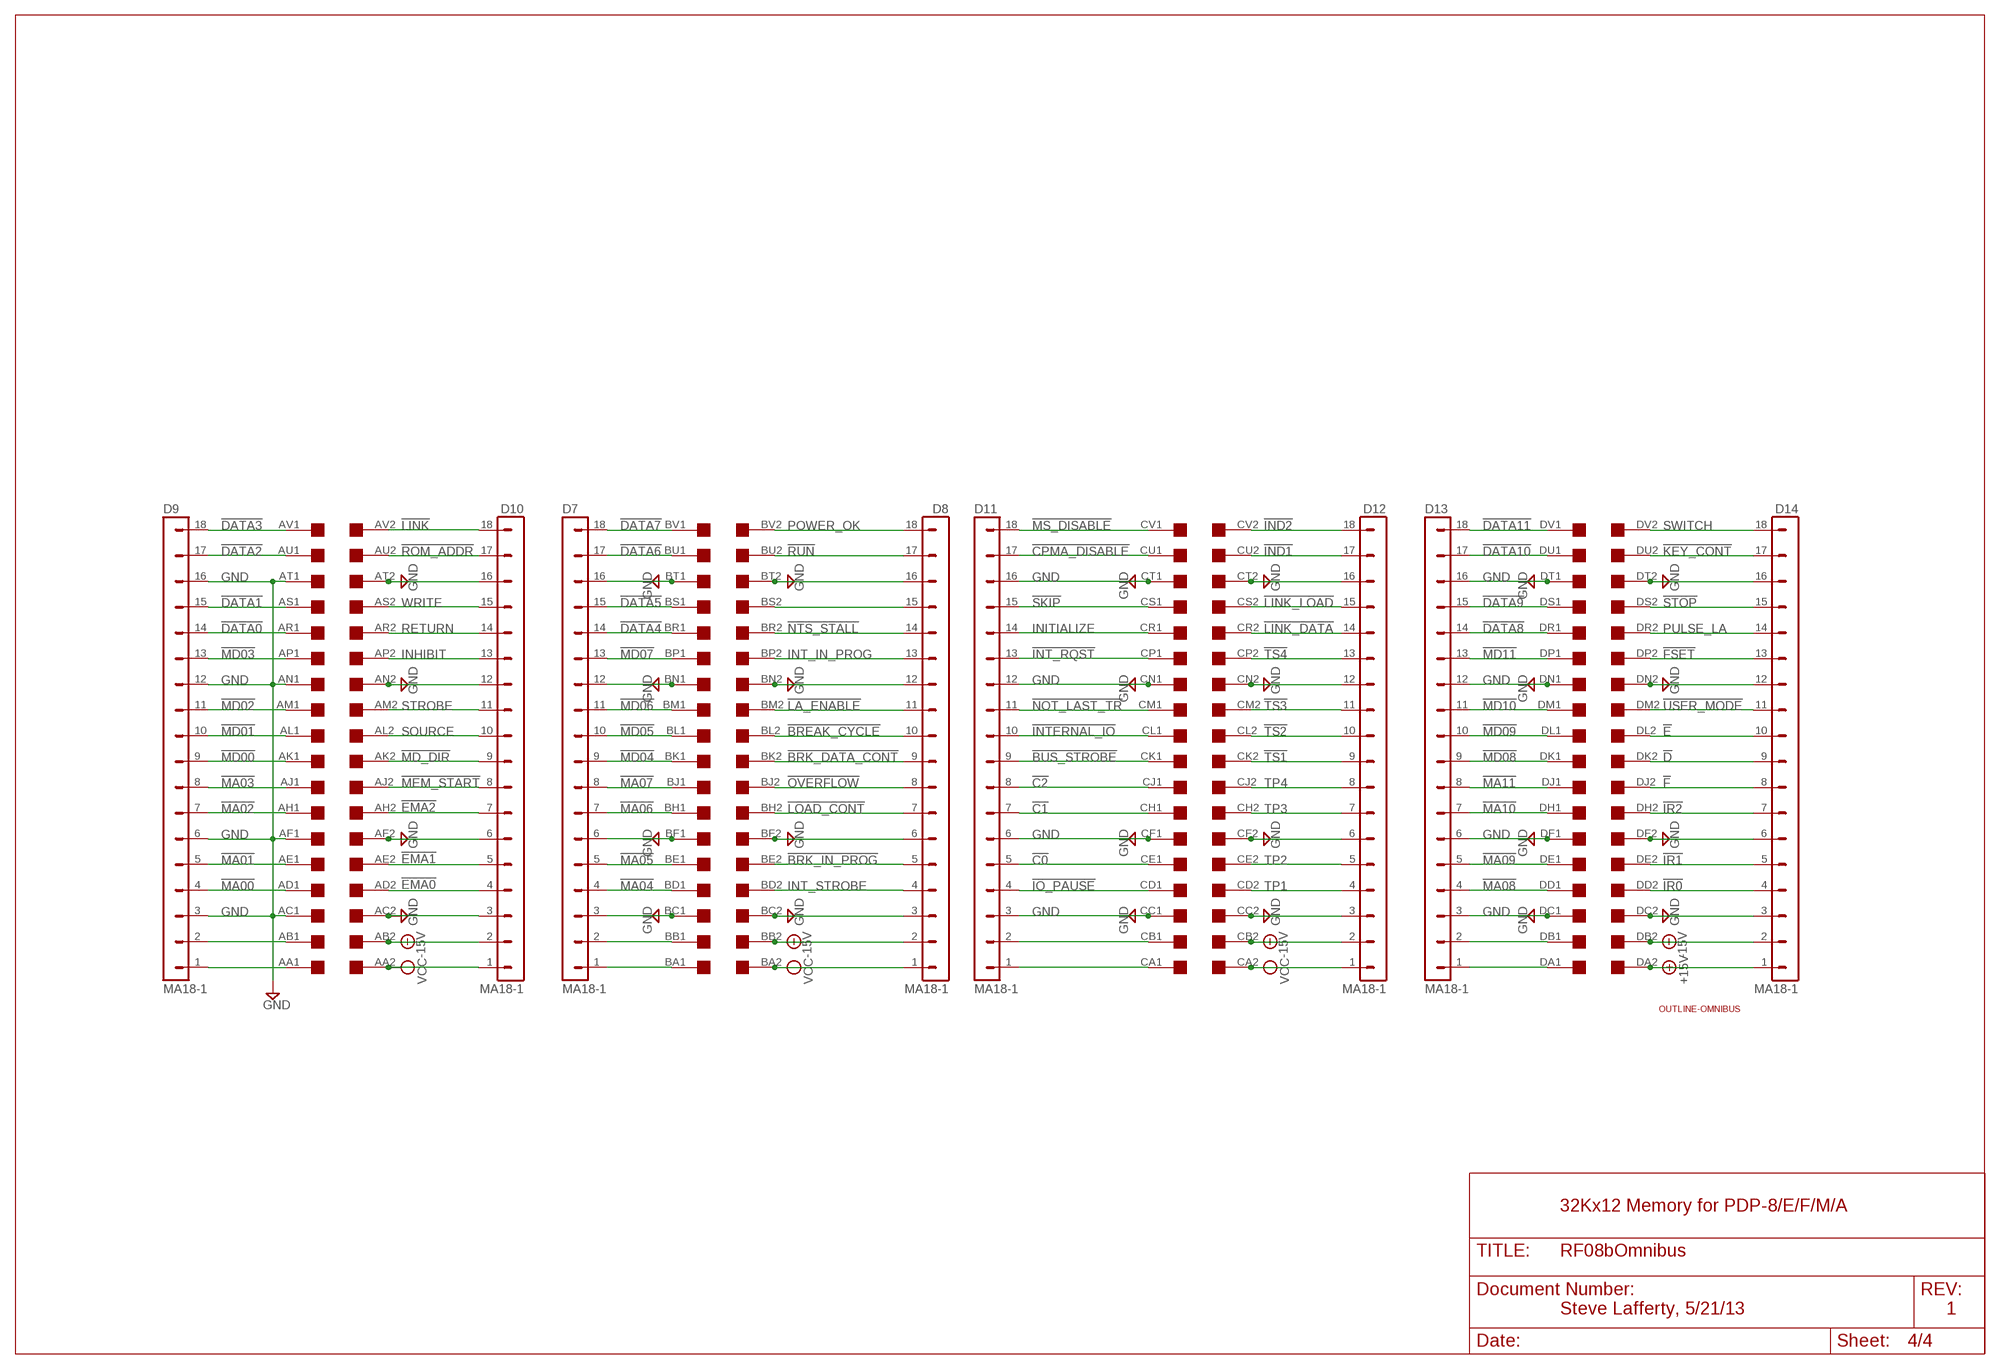
[diagram p3: schematic, sheet 4]

### Parts
D7  MA18-1  [MA18-1]
D8  MA18-1  [MA18-1]
D9  MA18-1  [MA18-1]
D10  MA18-1  [MA18-1]
D11  MA18-1  [MA18-1]
D12  MA18-1  [MA18-1]
D13  MA18-1  [MA18-1]
D14  MA18-1  [MA18-1]
U$15  OUTLINE-OMNIBUS  [OMNIBUS]
U$19  QUAD  [EDGE-CON8]

### Nets
!BREAK_CYCLE: D8.10 U$19.BL2 ; also sheet 1
!BRK_DATA_CONT: D8.9 U$19.BK2 ; also sheet 1
!BRK_IN_PROG: D8.5 U$19.BE2 ; also sheet 1
!BUS_STROBE: D11.9 U$19.CK1
!C0: D11.5 U$19.CE1 ; also sheet 1
!C1: D11.7 U$19.CH1 ; also sheet 1
!C2: D11.8 U$19.CJ1
!CPMA_DISABLE: D11.17 U$19.CU1 ; also sheet 1
!D: D14.9 U$19.DK2
!DATA0: D9.14 U$19.AR1 ; also sheet 1,2,3
!DATA1: D9.15 U$19.AS1 ; also sheet 1,2,3
!DATA2: D9.17 U$19.AU1 ; also sheet 1,2,3
!DATA3: D9.18 U$19.AV1 ; also sheet 1,2,3
!DATA4: D7.14 U$19.BR1 ; also sheet 1,2,3
!DATA5: D7.15 U$19.BS1 ; also sheet 1,2,3
!DATA6: D7.17 U$19.BU1 ; also sheet 1,2,3
!DATA7: D7.18 U$19.BV1 ; also sheet 1,2,3
!DATA8: D13.14 U$19.DR1 ; also sheet 2,3
!DATA9: D13.15 U$19.DS1 ; also sheet 2,3
!DATA10: D13.17 U$19.DU1 ; also sheet 2,3
!DATA11: D13.18 U$19.DV1 ; also sheet 2,3
!E: D14.10 U$19.DL2
!EMA0: D10.4 U$19.AD2 ; also sheet 1,3
!EMA1: D10.5 U$19.AE2 ; also sheet 1,3
!EMA2: D10.7 U$19.AH2 ; also sheet 1,3
!F: D14.8 U$19.DJ2
!FSET: D14.13 U$19.DP2
!IND1: D12.17 U$19.CU2
!IND2: D12.18 U$19.CV2
!INT_RQST: D11.13 U$19.CP1
!INTERNAL_IO: D11.10 U$19.CL1 ; also sheet 1
!IO_PAUSE: D11.4 U$19.CD1 ; also sheet 1
!IR0: D14.4 U$19.DD2
!IR1: D14.5 U$19.DE2
!IR2: D14.7 U$19.DH2
!KEY_CONT: D14.17 U$19.DU2
!LA_ENABLE: D8.11 U$19.BM2
!LINK: D10.18 U$19.AV2
!LINK_DATA: D12.14 U$19.CR2
!LINK_LOAD: D12.15 U$19.CS2
!LOAD_CONT: D8.7 U$19.BH2 ; also sheet 1
!MA00: D9.4 U$19.AD1 ; also sheet 1,3
!MA01: D9.5 U$19.AE1 ; also sheet 1,3
!MA02: D9.7 U$19.AH1 ; also sheet 1,3
!MA03: D9.8 U$19.AJ1 ; also sheet 1,3
!MA04: D7.4 U$19.BD1 ; also sheet 1,3
!MA05: D7.5 U$19.BE1 ; also sheet 1,3
!MA06: D7.7 U$19.BH1 ; also sheet 1,3
!MA07: D7.8 U$19.BJ1 ; also sheet 1,3
!MA08: D13.4 U$19.DD1 ; also sheet 1,3
!MA09: D13.5 U$19.DE1 ; also sheet 1,3
!MA10: D13.7 U$19.DH1 ; also sheet 1,3
!MA11: D13.8 U$19.DJ1 ; also sheet 1,3
!MD00: D9.9 U$19.AK1 ; also sheet 3
!MD01: D9.10 U$19.AL1 ; also sheet 3
!MD02: D9.11 U$19.AM1 ; also sheet 3
!MD03: D9.13 U$19.AP1 ; also sheet 3
!MD04: D7.9 U$19.BK1 ; also sheet 3
!MD05: D7.10 U$19.BL1 ; also sheet 3
!MD06: D7.11 U$19.BM1 ; also sheet 3
!MD07: D7.13 U$19.BP1 ; also sheet 3
!MD08: D13.9 U$19.DK1 ; also sheet 3
!MD09: D13.10 U$19.DL1 ; also sheet 3
!MD10: D13.11 U$19.DM1 ; also sheet 3
!MD11: D13.13 U$19.DP1 ; also sheet 3
!MD_DIR: D10.9 U$19.AK2 ; also sheet 3
!MEM_START: D10.8 U$19.AJ2
!MS_DISABLE: D11.18 U$19.CV1 ; also sheet 1
!NOT_LAST_TR: D11.11 U$19.CM1
!NTS_STALL: D8.14 U$19.BR2
!OVERFLOW: D8.8 U$19.BJ2 ; also sheet 1
!ROM_ADDR: D10.17 U$19.AU2
!RUN: D8.17 U$19.BU2
!SKIP: D11.15 U$19.CS1 ; also sheet 1
!STOP: D14.15 U$19.DS2
!TS1: D12.9 U$19.CK2
!TS2: D12.10 U$19.CL2
!TS3: D12.11 U$19.CM2
!TS4: D12.13 U$19.CP2 ; also sheet 1
!USER_MODE: D14.11 U$19.DM2
+15V: D14.1 U$19.DA2
-15V [Power]: D8.2 D10.2 D12.2 D14.2 U$19.AB2 U$19.BB2 U$19.CB2 U$19.DB2
GND: D7.3 D7.6 D7.12 D7.16 D8.3 D8.6 D8.12 D8.16 D9.3 D9.6 D9.12 D9.16 D10.3 D10.6 D10.12 D10.16 D11.3 D11.6 D11.12 D11.16 D12.3 D12.6 D12.12 D12.16 D13.3 D13.6 D13.12 D13.16 D14.3 D14.6 D14.12 D14.16 U$19.AC1 U$19.AC2 U$19.AF1 U$19.AF2 U$19.AN1 U$19.AN2 U$19.AT1 U$19.AT2 U$19.BC1 U$19.BC2 U$19.BF1 U$19.BF2 U$19.BN1 U$19.BN2 U$19.BT1 U$19.BT2 U$19.CC1 U$19.CC2 U$19.CF1 U$19.CF2 U$19.CN1 U$19.CN2 U$19.CT1 U$19.CT2 U$19.DC1 U$19.DC2 U$19.DF1 U$19.DF2 U$19.DN1 U$19.DN2 U$19.DT1 U$19.DT2 ; also sheet 1,2,3
INHIBIT: D10.13 U$19.AP2
INITIALIZE: D11.14 U$19.CR1 ; also sheet 1
INT_IN_PROG: D8.13 U$19.BP2
INT_STROBE: D8.4 U$19.BD2 ; also sheet 1
N$31: D13.1 U$19.DA1
N$35: D13.2 U$19.DB1
N$46: D9.2 U$19.AB1
N$47: D9.1 U$19.AA1
N$48: D7.2 U$19.BB1
N$49: D7.1 U$19.BA1
N$50: D11.1 U$19.CA1
N$51: D8.15 U$19.BS2
N$52: D11.2 U$19.CB1
POWER_OK: D8.18 U$19.BV2 ; also sheet 3
PULSE_LA: D14.14 U$19.DR2
RETURN: D10.14 U$19.AR2
SOURCE: D10.10 U$19.AL2
STROBE: D10.11 U$19.AM2
SWITCH: D14.18 U$19.DV2
TP1: D12.4 U$19.CD2 ; also sheet 1
TP2: D12.5 U$19.CE2
TP3: D12.7 U$19.CH2 ; also sheet 1,3
TP4: D12.8 U$19.CJ2 ; also sheet 1
VCC [Power]: D8.1 D10.1 D12.1 U$19.AA2 U$19.BA2 U$19.CA2 ; also sheet 1,2,3
WRITE: D10.15 U$19.AS2

### Notes on the sheet
- 32Kx12 Memory for PDP-8/E/F/M/A
- Steve Lafferty, 5/21/13 | 1

## Power pins joined to a net without a drawn wire
GND: DAR4-7.8(GND) DAR8-11.8(GND) DMA0-3.8(GND) DMA4-7.8(GND) DMA8-11.8(GND) FIELD.8(GND) IC1.8(GND) IC2.8(GND) IC3.8(GND) IC4.8(GND) IC5.7(P:GND) IC6.8(P:GND) IC7.8(P:GND) IC9.7(P:GND) IC10.7(P:GND) IC11.7(P:GND) IC12.7(P:GND) IC13.7(GND) IC14.7(GND) IC15.7(GND) IC16.7(P:GND) IC17.8(P:GND) IC18.7(P:GND) IC19.7(P:GND) IC21.8(P:GND) IC22.7(P:GND) IC23.10(GND) IC24.10(P:GND) IC25.8(GND) IC26.10(P:GND) IC28.10(GND) IC29.8(GND) IC30.10(P:GND) IC31.10(P:GND) IC32.8(GND) IC34.10(GND) IC35.10(P:GND) IC36.8(GND) IC37.8(GND) IC38.7(P:GND) IC39.10(GND) IC40.7(P:GND) IC41.7(P:GND) IC42.7(GND) IC43.7(P:GND) IC44.10(GND) IC45.10(GND) IC46.7(P:GND) IC49.10(GND) IC50.10(GND) IC51.8(GND) IC52.7(P:GND) IC53.8(GND) IC54.8(GND) IC55.8(GND) INTENB.8(GND)
VCC: DAR4-7.16(VCC) DAR8-11.16(VCC) DMA0-3.16(VCC) DMA4-7.16(VCC) DMA8-11.16(VCC) FIELD.16(VCC) IC1.16(VCC) IC2.16(VCC) IC3.16(VCC) IC4.16(VCC) IC5.14(P:VCC) IC6.16(P:VCC) IC7.16(P:VCC) IC9.14(P:VCC) IC10.14(P:VCC) IC11.14(P:VCC) IC12.14(P:VCC) IC13.14(VCC) IC14.14(VCC) IC15.14(VCC) IC16.14(P:VCC) IC17.16(P:VCC) IC18.14(P:VCC) IC19.14(P:VCC) IC21.16(P:VCC) IC22.14(P:VCC) IC23.20(VCC) IC24.20(P:VCC) IC25.16(VCC) IC26.20(P:VCC) IC28.20(VCC) IC29.16(VCC) IC30.20(P:VCC) IC31.20(P:VCC) IC32.16(VCC) IC34.20(VCC) IC35.20(P:VCC) IC36.16(VCC) IC37.16(VCC) IC38.14(P:VCC) IC39.20(VCC) IC40.14(P:VCC) IC41.14(P:VCC) IC42.14(VCC) IC43.14(P:VCC) IC44.20(VCC) IC45.20(VCC) IC46.14(P:VCC) IC49.20(VCC) IC50.20(VCC) IC51.16(VCC) IC52.14(P:VCC) IC53.16(VCC) IC54.16(VCC) IC55.16(VCC) INTENB.16(VCC)

## Library data of the parts
60XX 61XX 62XX 63XX 64XX 65XX 66XX 67XX MYDEV = wirepad:1,6/0,8: THROUGH-HOLE PAD
C1-C44 C46-C50 = rcl:C-US: CAPACITOR, American symbol
C45 = rcl:CPOL-US: POLARIZED CAPACITOR, American symbol
D7-D14 = dec-con:MA18-1
DAR4-7 DAR8-11 DMA0-3 DMA4-7 DMA8-11 FIELD INTENB = 74xx-us:74*192: Synchronous 4-bit UP/DOWN COUNTER
IC1-IC4 IC53 = 74xx-us:74*151: Data SELECTOR/MULTIPLEXER
IC5 = 74xx-us:74*20: Dual 4-input NAND gate
IC6 IC7 IC17 IC21 = 74xx-us:74*139: Dual 2-line to 4-line DECODER/DEMULTIPLEXER
IC8 = linear:*556: Dual TIMER
IC9-IC11 IC40 = 74xx-us:74*74: Dual D type positive edge triggered FLIP FLOP, preset and clear
IC12 = 74xx-us:74*04: Hex INVERTER
IC13-IC15 = 74xx-us:74*180: 9-bit odd/even PARITY GENERATOR/CHECKER
IC16 IC52 = 74xx-us:74*02: Quad 2-input NOR gate
IC18 IC41 IC46 = 74xx-us:74*00: Quad 2-input NAND gate
IC19 IC22 IC43 = 74xx-us:74*07: Hex BUFFER, open collector high-voltage output
IC20 = ic-package:DIL20: Dual In Line / Socket
IC23 IC28 IC34 IC39 IC49 IC50 = 74xx-us:74*245: Octal BUS TRANSCEIVER, 3-state
IC24 IC26 IC30 IC31 IC35 = 74xx-us:74*240: Octal BUFFER and LINE DRIVER, 3-state
IC25 IC29 IC32 IC36 IC51 = 74xx-us:74*138: 3-line to 8-line DECODER/DEMULTIPLEXER
IC27 IC33 IC47 IC48 = dec-con:628512P: 512Kx8 Static RAM
IC37 = 74xx-us:74*175: Qadruple D type FLIP FLOP, clear
IC38 = dec-con:74*38: Quad 2-input NAND gate, open collector output
IC42 = 74xx-us:74*30: 8-input NAND gate
IC44 IC45 = 74xx-us:74*574: 8-bit D type FLIP FLOP bus driver
IC54 IC55 = 74xx-us:74*368: Hex BUS DRIVER, 3-state
Q1 Q2 = transistor-npn:2N3904: NPN Transistor
R1-R4 RA RA2 RB RB2 RL = rcl:R-US_: RESISTOR, American symbol
SV1 SV2 = con-lstb:MA13-2: PIN HEADER; OC_FARNELL: unknown; OC_NEWARK: unknown
SW1-SW4 = special:SW_DIP-8: DIP SWITCH
U$15 = dec-con:OUTLINE-*: Board outlines for DEC boards.
U$19 = dec-con:QUAD: Quad-Height DEC board

## Net classes
1 Power: width 0.813 mm